# EAGLE design control_boardv15 (EAGLE 9.5.2)
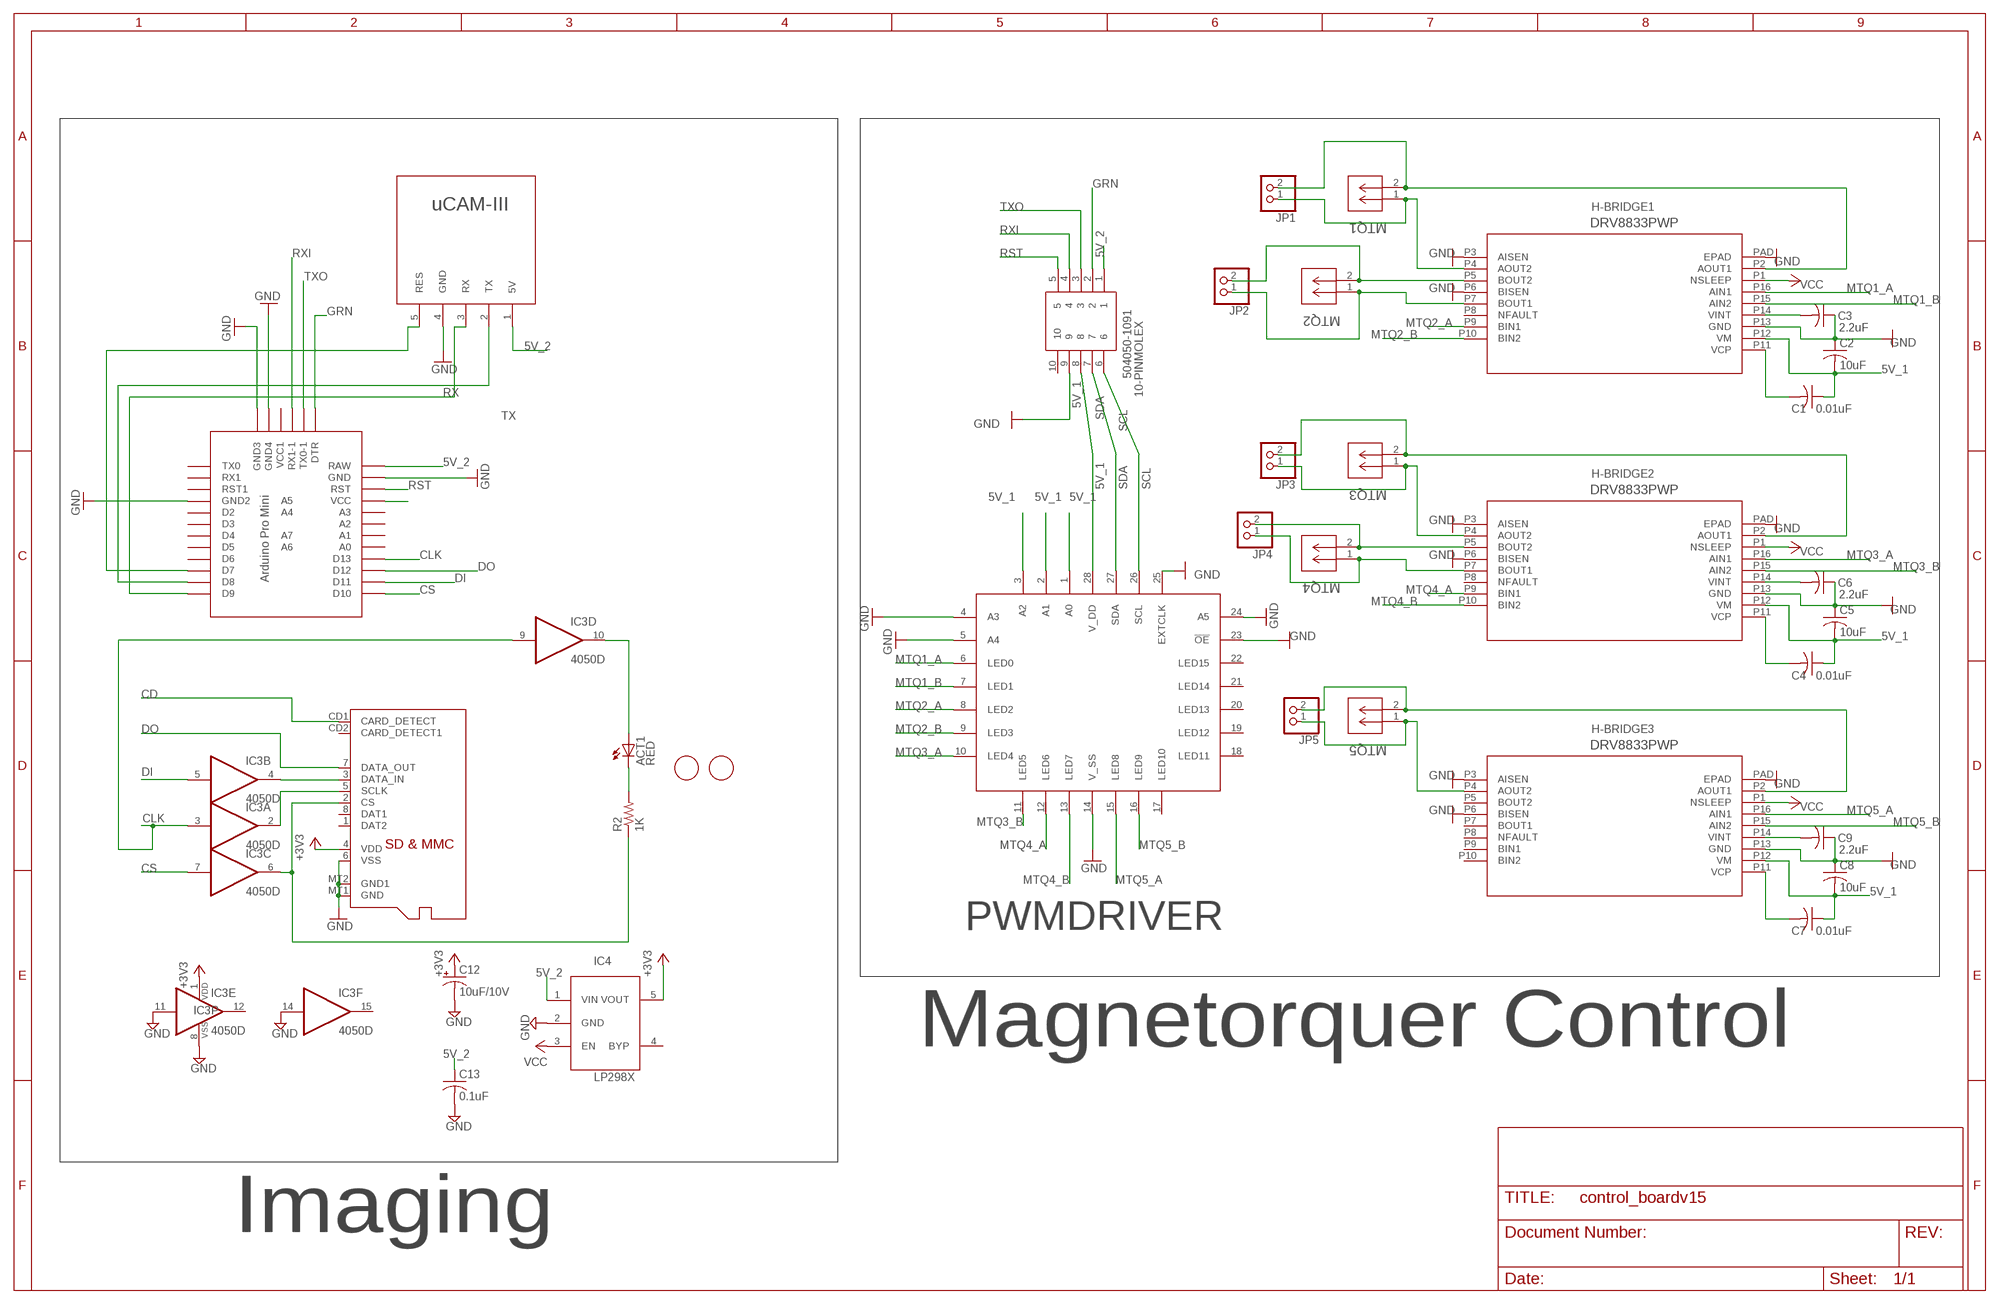
[diagram p0: schematic, sheet 1]

## Parts
10-PINMOLEX  504050-1091  [504050-1091]
ACT1  RED  LEDCHIP-LED0805  [CHIP-LED0805]
C1  0.01uF  C-USC0603K  [C0603K]
C2  10uF  C-USC1210K  [C1210K]
C3  2.2uF  C-USC0603K  [C0603K]
C4  0.01uF  C-USC0603K  [C0603K]
C5  10uF  C-USC1210K  [C1210K]
C6  2.2uF  C-USC0603K  [C0603K]
C7  0.01uF  C-USC0603K  [C0603K]
C8  10uF  C-USC1210K  [C1210K]
C9  2.2uF  C-USC0603K  [C0603K]
C12  10uF/10V  CPOL-USA/3216-18R  [A/3216-18R]
C13  0.1uF  C-USC0805K  [C0805K]
H-BRIDGE1  DRV8833PWP  [HTSSOP16]
H-BRIDGE2  DRV8833PWP  [HTSSOP16]
H-BRIDGE3  DRV8833PWP  [HTSSOP16]
IC3  4050D  [SO16]
IC4  LP298XS  [SOT23-5L]
JP1  PINHD-1X2  [1X02]
JP2  PINHD-1X2  [1X02]
JP3  PINHD-1X2  [1X02]
JP4  PINHD-1X2  [1X02]
JP5  PINHD-1X2  [1X02]
MTQ1  DF13C-2P-1.25V(51)  [CON2_1X2_U_DF13]
MTQ2  DF13C-2P-1.25V(51)  [CON2_1X2_U_DF13]
MTQ3  DF13C-2P-1.25V(51)  [CON2_1X2_U_DF13]
MTQ4  DF13C-2P-1.25V(51)  [CON2_1X2_U_DF13]
MTQ5  DF13C-2P-1.25V(51)  [CON2_1X2_U_DF13]
PWMDRIVER  PCA9685PW  [TSSOP28]
R2  1K  R-US_R0805  [R0805]
U$2  UCAM-III  [UCAM-III]
U$6  FIDUCIAL  [FIDUCIAL_1MM]
U$7  FIDUCIAL  [FIDUCIAL_1MM]
U$8  PRO-MINI-2  [PRO-MINI-2]
X2  MICROSD  [MICROSD]

## Nets
5V_1 [New Class]: 10-PINMOLEX.8 C1.1 C2.2 C4.1 C5.2 C7.1 C8.2 H-BRIDGE1.P12(VM) H-BRIDGE2.P12(VM) H-BRIDGE3.P12(VM) PWMDRIVER.1(A0) PWMDRIVER.2(A1) PWMDRIVER.3(A2) PWMDRIVER.28(V_DD)
5V_2 [New Class]: 10-PINMOLEX.1 C13.1 IC4.1(VIN) U$2.1(5V) U$8.RAW
+3V3: C12.+ IC3.1(P:VDD) IC4.5(VOUT) X2.4(VDD)
CD: X2.CD1(CARD_DETECT)
CLK: IC3.3(A:I) IC3.9(D:I) U$8.D13
CS: IC3.7(C:I) U$8.D10
DI: IC3.5(B:I) U$8.D11
DO: U$8.D12 X2.7(DATA_OUT)
GND [MTQs]: 10-PINMOLEX.9 C2.1 C3.1 C5.1 C6.1 C8.1 C9.1 C12.- C13.2 H-BRIDGE1.P3(AISEN) H-BRIDGE1.P6(BISEN) H-BRIDGE1.P13(GND) H-BRIDGE1.PAD(EPAD) H-BRIDGE2.P3(AISEN) H-BRIDGE2.P6(BISEN) H-BRIDGE2.P13(GND) H-BRIDGE2.PAD(EPAD) H-BRIDGE3.P3(AISEN) H-BRIDGE3.P6(BISEN) H-BRIDGE3.P13(GND) H-BRIDGE3.PAD(EPAD) IC3.8(P:VSS) IC3.11(E:I) IC3.14(F:I) IC4.2(GND) PWMDRIVER.4(A3) PWMDRIVER.5(A4) PWMDRIVER.14(V_SS) PWMDRIVER.23(!OE) PWMDRIVER.24(A5) PWMDRIVER.25(EXTCLK) U$2.4(GND) U$8.GND U$8.GND1(GND2) U$8.GND2(GND3) U$8.GND3(GND4) X2.6(VSS) X2.MT1(GND) X2.MT2(GND1)
GRN: 10-PINMOLEX.2 U$8.DTR
MTQ1_A: H-BRIDGE1.P16(AIN1) PWMDRIVER.6(LED0)
MTQ1_B: H-BRIDGE1.P15(AIN2) PWMDRIVER.7(LED1)
MTQ2_A: H-BRIDGE1.P9(BIN1) PWMDRIVER.8(LED2)
MTQ2_B: H-BRIDGE1.P10(BIN2) PWMDRIVER.9(LED3)
MTQ3_A: H-BRIDGE2.P16(AIN1) PWMDRIVER.10(LED4)
MTQ3_B: H-BRIDGE2.P15(AIN2) PWMDRIVER.11(LED5)
MTQ4_A: H-BRIDGE2.P9(BIN1) PWMDRIVER.12(LED6)
MTQ4_B: H-BRIDGE2.P10(BIN2) PWMDRIVER.13(LED7)
MTQ5_A: H-BRIDGE3.P16(AIN1) PWMDRIVER.15(LED8)
MTQ5_B: H-BRIDGE3.P15(AIN2) PWMDRIVER.16(LED9)
N$1 [MTQs]: H-BRIDGE2.P2(AOUT1) JP3.2 MTQ3.2
N$2: C3.2 H-BRIDGE1.P14(VINT)
N$3 [MTQs]: H-BRIDGE1.P4(AOUT2) JP1.1 MTQ1.1
N$4 [MTQs]: H-BRIDGE1.P2(AOUT1) JP1.2 MTQ1.2
N$5 [MTQs]: H-BRIDGE1.P7(BOUT1) JP2.1 MTQ2.1
N$6 [MTQs]: H-BRIDGE1.P5(BOUT2) JP2.2 MTQ2.2
N$7: C1.2 H-BRIDGE1.P11(VCP)
N$8 [MTQs]: H-BRIDGE2.P7(BOUT1) JP4.1 MTQ4.1
N$9 [MTQs]: H-BRIDGE2.P5(BOUT2) JP4.2 MTQ4.2
N$10: C6.2 H-BRIDGE2.P14(VINT)
N$11: C4.2 H-BRIDGE2.P11(VCP)
N$12 [MTQs]: H-BRIDGE2.P4(AOUT2) JP3.1 MTQ3.1
N$13 [MTQs]: H-BRIDGE3.P2(AOUT1) JP5.2 MTQ5.2
N$16: C9.2 H-BRIDGE3.P14(VINT)
N$17: C7.2 H-BRIDGE3.P11(VCP)
N$18 [MTQs]: H-BRIDGE3.P4(AOUT2) JP5.1 MTQ5.1
N$21: U$8.VCC
N$22: ACT1.A IC3.10(D:O)
N$23: IC3.2(A:O) X2.5(SCLK)
N$24: IC3.6(C:O) R2.1 X2.2(CS)
N$25: ACT1.C R2.2
N$26: IC3.4(B:O) X2.3(DATA_IN)
N$27: U$2.5(RES) U$8.D7
RST: 10-PINMOLEX.5 U$8.RST
RX: U$2.3(RX) U$8.D9
RXI: 10-PINMOLEX.4 U$8.RX1-1
SCL: 10-PINMOLEX.6 PWMDRIVER.26(SCL)
SDA: 10-PINMOLEX.7 PWMDRIVER.27(SDA)
TX: U$2.2(TX) U$8.D8
TXO: 10-PINMOLEX.3 U$8.TX0-1
VCC: H-BRIDGE1.P1(NSLEEP) H-BRIDGE2.P1(NSLEEP) H-BRIDGE3.P1(NSLEEP) IC4.3(EN)
Unconnected: 10-PINMOLEX.10 H-BRIDGE1.P8(NFAULT) H-BRIDGE2.P8(NFAULT) H-BRIDGE3.P5(BOUT2) H-BRIDGE3.P7(BOUT1) H-BRIDGE3.P8(NFAULT) H-BRIDGE3.P9(BIN1) H-BRIDGE3.P10(BIN2) IC3.12(E:O) IC3.15(F:O) IC4.4(BYP) PWMDRIVER.17(LED10) PWMDRIVER.18(LED11) PWMDRIVER.19(LED12) PWMDRIVER.20(LED13) PWMDRIVER.21(LED14) PWMDRIVER.22(LED15) U$8.A0 U$8.A1 U$8.A2 U$8.A3 U$8.A4 U$8.A5 U$8.A6 U$8.A7 U$8.D2 U$8.D3 U$8.D4 U$8.D5 U$8.D6 U$8.RST1 U$8.RX1 U$8.TX0 U$8.VCC1 X2.1(DAT2) X2.8(DAT1) X2.CD2(CARD_DETECT1)

## Notes on the sheet
- Magnetorquer Control
- Imaging

## Library data of the parts
10-PINMOLEX = molex_10pin:504050-1091: Pico-Lock SMT Wire-to-Board Header 10way Molex 504050 Series, 1.5mm Pitch 10 Way 1 Row Right Angle PCB Header, SMT Termination, 3A Source: Datasheet <https://componentsearchengine.com/Datasheets/1/504050-1091.pdf>; DESCRIPTION: Pico-Lock SMT Wire-to-Board Header 10way Molex 504050 Series, 1.5mm Pitch 10 Way 1 Row Right Angle PCB Header, SMT Termination, 3A; HEIGHT: mm; MANUFACTURER_NAME: Molex; MANUFACTURER_PART_NUMBER: 504050-1091; MOUSER_PART_NUMBER: 538-504050-1091; MOUSER_PRICE-STOCK: https://www.mouser.com/Search/Refine.aspx?Keyword=538-504050-1091
ACT1 = adafruit:LED: LED OSRAM: - CHIPLED LG R971, LG N971, LY N971, LG Q971, LY Q971, LO R971, LY R971 LH N974, LH R974 LS Q976, LO Q976, LY Q976 LO Q996 - Hyper CHIPLED LW Q18S LB Q993, LB Q99A, LB R99A - SideLED LS A670, LO A670, LY A670, LG A670, LP A670 LB A673, LV A673, LT A673, LW A673 LH A674 LY A675 LS A676, LA A676, LO A676, LY A676, LW A676 LS A679, LY A679, LG A679 - Hyper Micro SIDELED® LS Y876, LA Y876, LO Y876, LY Y876 LT Y87S - SmartLED LW L88C, LW L88S LB L89C, LB L89S, LG L890 LS L89K, LO L89K, LY L89K LS L896, LA L896, LO L896, LY L896 - TOPLED LS T670, LO T670, LY T670, LG T670, LP T670 LSG T670, LSP T670, LSY T670, LOP T670, LYG T670 LG T671, LOG T671, LSG T671 LB T673, LV T673, LT T673, LW T673 LH T674 LS T676, LA T676, LO T676, LY T676, LB T676, LH T676, LSB T676, LW T676 LB T67C, LV T67C, LT T67C, LS T67K, LO T67K, LY T67K, LW E67C LS E67B, LA E67B, LO E67B, LY E67B, LB E67C, LV E67C, LT E67C LW T67C LS T679, LY T679, LG T679 LS T770, LO T770, LY T770, LG T770, LP T770 LB T773, LV T773, LT T773, LW T773 LH T774 LS E675, LA E675, LY E675, LS T675 LS T776, LA T776, LO T776, LY T776, LB T776 LHGB T686 LT T68C, LB T68C - Hyper Mini TOPLED® LB M676 - Mini TOPLED Santana® LG M470 LS M47K, LO M47K, LY M47K Source: http://www.osram.convergy.de/
C1-C9 = rcl:C-US: CAPACITOR, American symbol; SPICEPREFIX: C
C12 = adafruit:CPOL-US: POLARIZED CAPACITOR, American symbol
C13 = adafruit:C-US: CAPACITOR, American symbol
H-BRIDGE1-H-BRIDGE3 = myparts:DRV8833PWP
IC3 = 40xx:4050: Hex non-inverting BUFFER
IC4 = adafruit:LP298X
JP1-JP5 = pinhead:PINHD-1X2: PIN HEADER
MTQ1-MTQ5 = myparts:DF13C-2P-1.25V(51); BUILT_BY: EMA_UL_Team; MANUFACTURER_PART_NUMBER: DF13C-2P-1.25V(51); VENDOR: Hirose
PWMDRIVER = myparts:PCA9685PW
R2 = adafruit:R-US_: RESISTOR, American symbol
U$2 = myparts:UCAM-III
U$6 U$7 = adafruit:FIDUCIAL: For use by pick and place machines to calibrate the vision/machine, 1mm By microbuilder.eu
U$8 = myparts:PRO-MINI-2: Arduino Pro Mini Layout 2 Sparkfun.com
X2 = adafruit:MICROSD: Micro-SD / Transflash card holder with SPI pinout For the 3M # 2908-05WB-MG and/or 4UCON #19656 push-push type

## Net classes
0 default: width 0.152 mm
1 New Class: width 0.457 mm
2 MTQs: width 0.305 mm

## Board
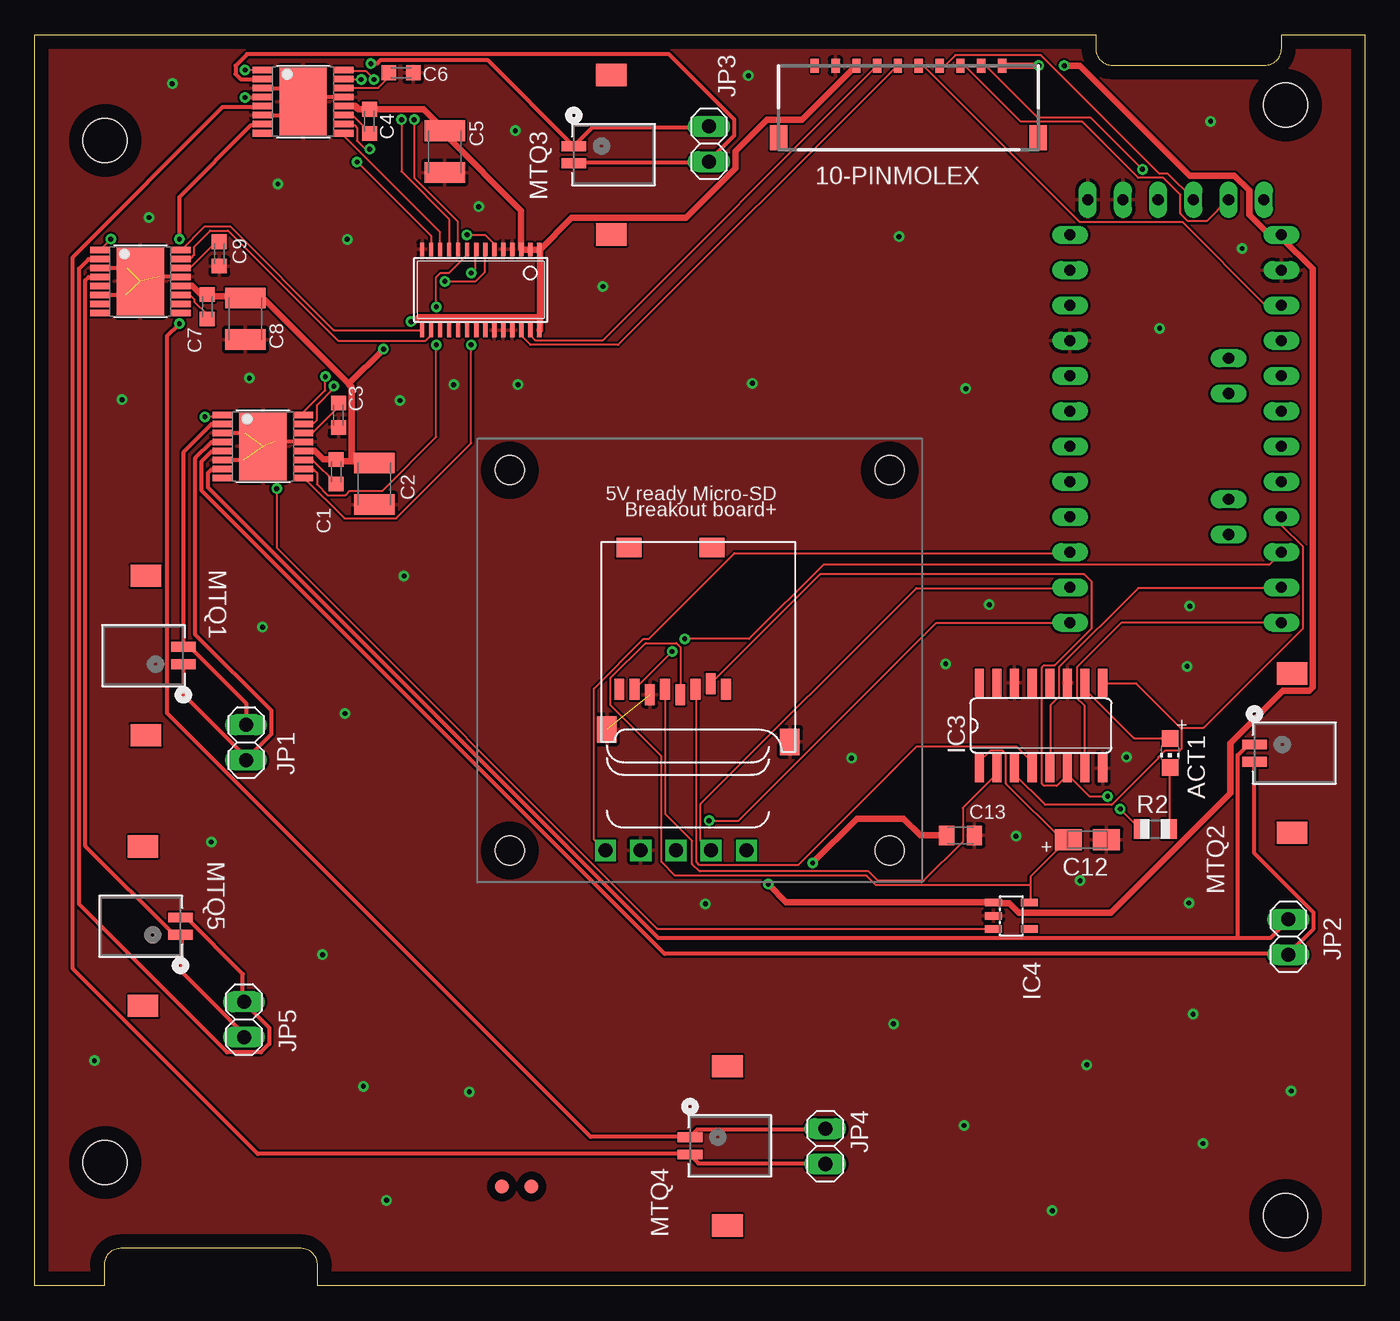
[diagram p1: board, top side]
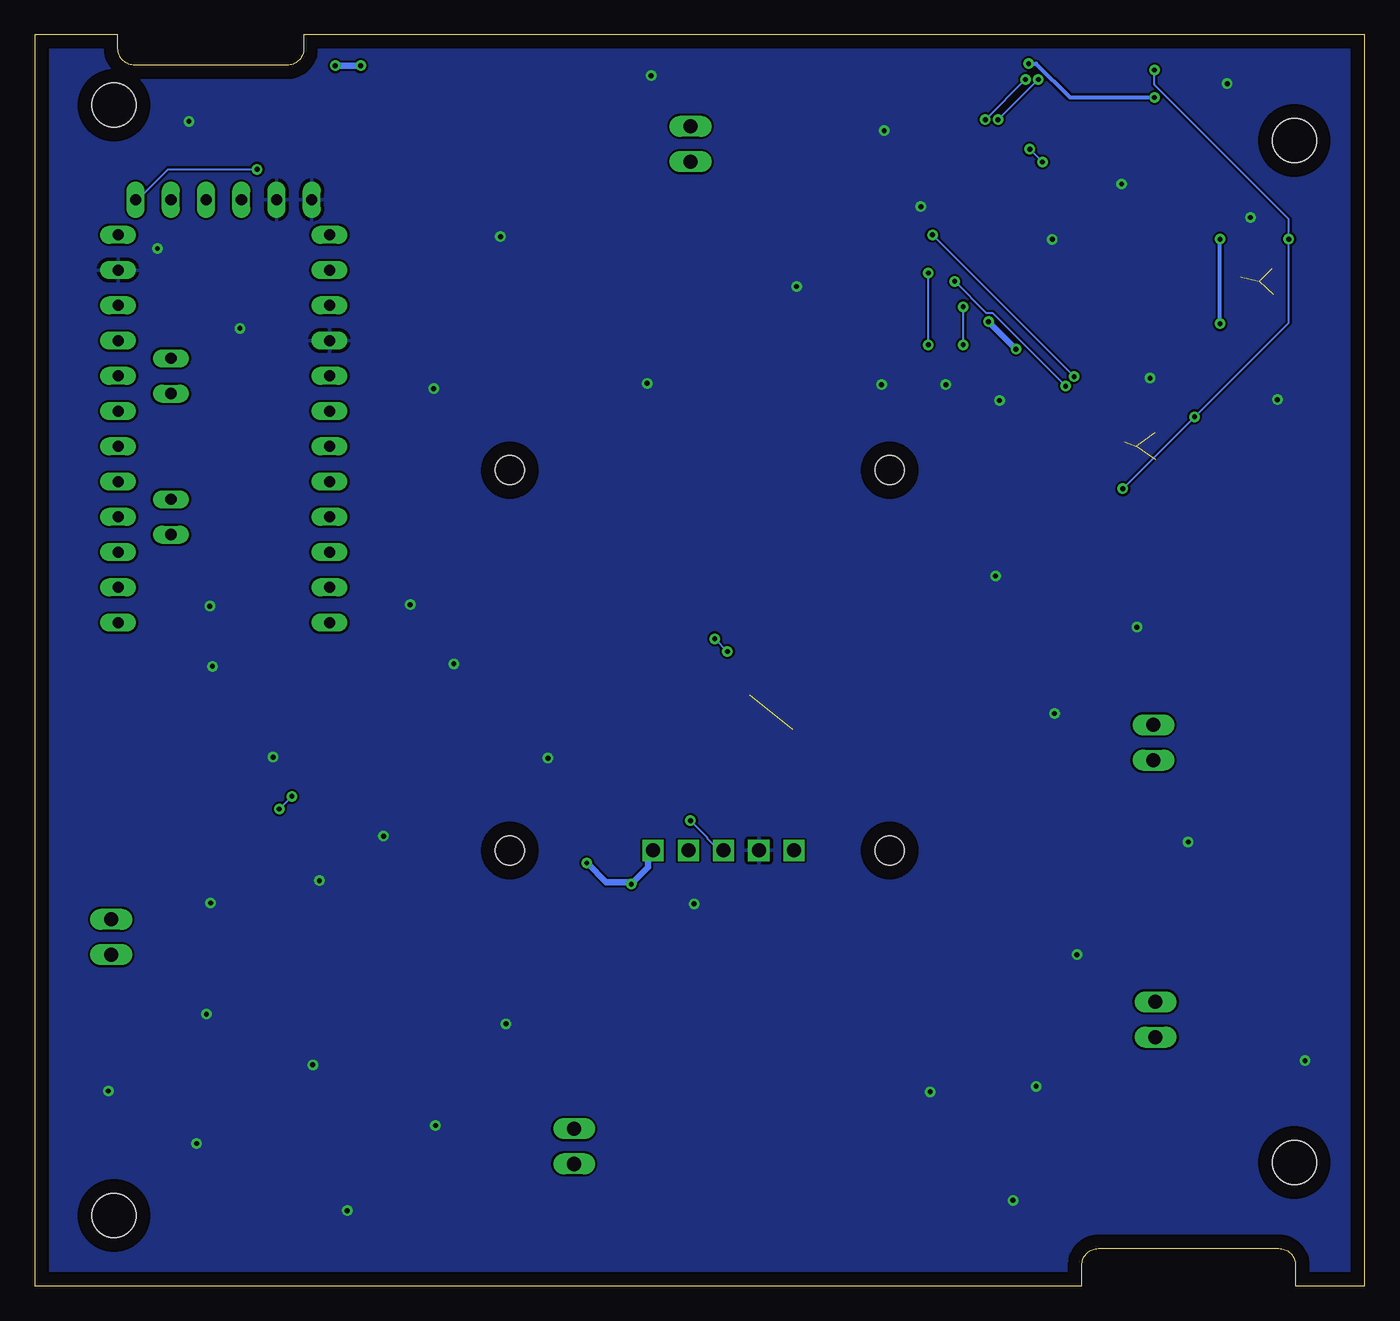
[diagram p2: board, bottom side, seen from below]

Size 95.89 x 90.17 mm. Coordinates in mm from the lower left corner, seen from the top.
Outline: 20.4,0 20.4,1.5 arc90 19.2,2.7 6.2,2.7 arc90 5,1.5 5,0 0,0 0,90.17 76.49,90.17 76.49,89.17 arc90 77.69,87.97 88.69,87.97 arc90 89.89,89.17 89.89,90.17 95.89,90.17 95.89,0 20.4,0
Copper layers (1*16): Top 0.035mm / dielectric 1.5mm / Bottom 0.035mm
Design rules "default": minimum track width 6mil, minimum drill 0.35mm, track to track 6mil, track to pad 6mil, pad to pad 6mil, via to via 6mil, smd to smd 6mil, copper to edge 40mil, drill to drill 6mil, minimum pad ring 10mil, minimum via ring 8mil, stop-mask expansion 4mil, vias tented up to drill 0mil, thermal gap 10mil
Holes 3.17 mm at 5.08,82.55 5.08,8.89 90.17,5.08 90.17,85.09

### Footprints (pad centres in the part's own frame; a part is rotated, then mirrored left to right if it is on the bottom)
504050-1091 = smd 0.6 x 1: 1 -13.5,0; 2 -12,0; 3 -10.5,0; 4 -9,0; 5 -7.5,0; 6 -6,0; 7 -4.5,0; 8 -3,0; 9 -1.5,0; 10 0,0 | smd 1.25 x 1.8: 11 2.605,5.19; 12 -16.105,5.19
CHIP-LED0805 = smd 1.2 x 1.2: A 0,-1.05; C 0,1.05
C0603K = smd 1.05 x 1.08: 1 -0.875,0; 2 0.875,0
C1210K = smd 1.5 x 2.9: 1 -1.5,0; 2 1.5,0
A/3216-18R = smd 1.95 x 1.5: + 1.375,0; - -1.375,0
C0805K = smd 1.1 x 1.4: 1 -1,0; 2 1,0
HTSSOP16 = smd 1.5 x 0.45: P1 -2.9,2.275; P2 -2.9,1.625; P3 -2.9,0.975; P4 -2.9,0.325; P5 -2.9,-0.325; P6 -2.9,-0.975; P7 -2.9,-1.625; P8 -2.9,-2.275; P9 2.9,-2.275; P10 2.9,-1.625; P11 2.9,-0.975; P12 2.9,-0.325; P13 2.9,0.325; P14 2.9,0.975; P15 2.9,1.625; P16 2.9,2.275 | smd 3.4 x 5: PAD 0,0
SO16 = smd 0.66 x 2.032: 1 -4.445,-3.073; 2 -3.175,-3.073; 3 -1.905,-3.073; 4 -0.635,-3.073; 5 0.635,-3.073; 6 1.905,-3.073; 7 3.175,-3.073; 8 4.445,-3.073; 9 4.445,3.073; 10 3.175,3.073; 11 1.905,3.073; 12 0.635,3.073; 13 -0.635,3.073; 14 -1.905,3.073; 15 -3.175,3.073; 16 -4.445,3.073
SOT23-5L = smd 0.55 x 1.2: 1 -0.95,-1.3; 2 0,-1.3; 3 0.95,-1.3; 4 0.95,1.3; 5 -0.95,1.3
1X02 = drill 1.016 long: 1 -1.27,0; 2 1.27,0
CON2_1X2_U_DF13 = smd 0.711 x 1.778: 1 0,0; 2 -1.25,0 | smd 1.6 x 2.21: 3 -6.365,-2.7; 5 5.115,-2.7
TSSOP28 = smd 0.305 x 0.991: 1 -4.225,-2.918; 2 -3.575,-2.918; 3 -2.925,-2.918; 4 -2.275,-2.918; 5 -1.625,-2.918; 6 -0.975,-2.918; 7 -0.325,-2.918; 8 0.325,-2.918; 9 0.975,-2.918; 10 1.625,-2.918; 11 2.275,-2.918; 12 2.925,-2.918; 13 3.575,-2.918; 14 4.225,-2.918; 15 4.225,2.918; 16 3.575,2.918; 17 2.925,2.918; 18 2.275,2.918; 19 1.625,2.918; 20 0.975,2.918; 21 0.325,2.918; 22 -0.325,2.918; 23 -0.975,2.918; 24 -1.625,2.918; 25 -2.275,2.918; 26 -2.925,2.918; 27 -3.575,2.918; 28 -4.225,2.918
R0805 = smd 1.1 x 1.4: 1 -1,0; 2 1,0
UCAM-III = drill 1.02 square: 1 19.36,2.3; 2 16.82,2.3; 3 14.28,2.3; 4 11.74,2.3; 5 9.2,2.3 | hole 2.1: 2.3,2.3; 29.7,2.3; 29.7,29.7; 2.3,29.7
FIDUCIAL_1MM = smd 1 x 1: 1 0,0
PRO-MINI-2 = drill 0.8 long: A0 6.35,2.54; A1 6.35,0; A2 6.35,-2.54; A3 6.35,-5.08; A4 2.54,1.27; A5 2.54,3.81; A6 2.54,-8.89; A7 2.54,-6.35; D2 -8.89,2.54; D3 -8.89,0; D4 -8.89,-2.54; D5 -8.89,-5.08; D6 -8.89,-7.62; D7 -8.89,-10.16; D8 -8.89,-12.7; D9 -8.89,-15.24; D10 6.35,-15.24; D11 6.35,-12.7; D12 6.35,-10.16; D13 6.35,-7.62; DTR 5.08,15.24; GND 6.35,10.16; GND1 -8.89,5.08; GND2 -7.62,15.24; GND3 -5.08,15.24; RAW 6.35,12.7; RST 6.35,7.62; RST1 -8.89,7.62; RX1 -8.89,10.16; RX1-1 0,15.24; TX0 -8.89,12.7; TX0-1 2.54,15.24; VCC 6.35,5.08; VCC1 -2.54,15.24
MICROSD = smd 0.7 x 1.5: 1 9,-10.64; 2 7.9,-10.24; 3 6.8,-10.64; 4 5.7,-11.04; 5 4.6,-10.64; 6 3.5,-11.04; 7 2.4,-10.64; 8 1.3,-10.64 | smd 1.8 x 1.4: CD1 2,-0.44; CD2 8,-0.44 | smd 1.4 x 1.9: MT1 0.4,-13.54; MT2 13.6,-14.44

### Placement (x,y rotation side)
10-PINMOLEX  56.24,87.93 180 top
ACT1  81.84,38.4 180 top
C1  21.74,58.67 270 top
C2  24.49,57.81 90 top
C3  21.89,62.74 90 top
C4  24.13,83.92 270 top
C5  29.57,81.74 90 top
C6  26.42,87.43 180 top
C7  12.45,70.56 270 top
C8  15.19,69.7 90 top
C9  13.31,74.37 90 top
C12  75.9,32.16 180 top
C13  66.75,32.46 0 top
H-BRIDGE1  16.46,60.5 0 top
H-BRIDGE2  19.35,85.34 0 top
H-BRIDGE3  7.62,72.39 0 top
IC3  72.54,40.39 0 top
IC4  70.41,26.67 270 top
JP1  15.24,39.17 90 top
JP2  90.37,25.15 270 top
JP3  48.62,82.3 270 top
JP4  57,10.06 270 top
JP5  15.09,19.2 90 top
MTQ1  10.72,44.81 270 top
MTQ2  87.93,39.01 90 top
MTQ3  38.86,82.14 90 top
MTQ4  47.24,10.72 90 top
MTQ5  10.52,25.3 270 top
PWMDRIVER  32.16,71.78 180 top
R2  80.77,32.92 0 top
U$2  31.95,29.09 0 top
U$6  33.68,7.16 0 top
U$7  35.81,7.16 0 top
U$8  83.53,63.04 0 top
X2  40.84,53.64 0 top

### Tracks (layer width: path | path; a pad name or v marks a point on that pad's centre or on a via)
5V_1  (via drill 0.35)
  Top 0.457: H-BRIDGE3.P12 10.59,72.08 11.35,72.08 11.96,71.48 12.42,71.48 C7.1 12.65,71.32 15.09,71.32 15.16,71.25 C8.2 15.39,71.09 16.54,71.09 22.63,65 | H-BRIDGE1.P12 19.43,60.2 20.19,60.2 20.8,59.59 21.72,59.59 C1.1 21.95,59.44 22.86,59.44 | 22.86,59.44 24.38,59.44 24.46,59.36 C2.2 | 22.63,65 22.86,64.77 22.86,59.44 | H-BRIDGE2.P12 22.33,85.04 23.09,85.04 23.32,84.81 24.08,84.81 C4.1 24.31,84.81 28.04,84.81 29.57,83.29 C5.2 29.64,83.06 29.64,82.91 35.05,77.5 35.05,74.91 PWMDRIVER.3 35.13,74.68 35.66,74.68 PWMDRIVER.2 35.97,74.68 36.2,74.68 PWMDRIVER.1 36.42,74.68 | 36.42,74.68 36.42,69.8 | 36.42,69.8 36.42,68.89 PWMDRIVER.28 | 36.42,74.68 38.71,76.96 46.94,76.96 50.52,80.54 50.52,81.76 52.81,84.05 55.32,84.05 59.21,87.94 10-PINMOLEX.8 | v25.15,67.51 22.63,65 | v27.13,69.49 27.36,69.49 27.66,69.8 36.42,69.8
  Bottom 0.457: v27.13,69.49 v25.15,67.51
5V_2  (via drill 0.35)
  Top 0.457: v52.88,28.96 54.18,27.66 69.04,27.66 IC4.1 69.34,27.58 70.26,27.58 70.94,26.9 77.57,26.9 86.18,35.51 86.18,39.09 89.99,42.9 91.9,42.9 92.13,43.13 92.13,73.3 89.92,75.51 U$8.RAW 89.84,75.74 89,75.74 87.55,77.19 87.55,78.94 86.49,80.01 83.29,80.01 75.36,87.94 v74.22,87.94 | C13.1 63.86,32.46 62.64,33.68 59.28,33.68 v56.08,30.48 | v72.39,87.94 10-PINMOLEX.1
  Bottom 0.457: U$2.1 51.36,31.32 51.66,31.01 51.66,30.18 v52.88,28.96 53.03,29.11 54.71,29.11 v56.08,30.48 | v74.22,87.94 v72.39,87.94
+3V3
  Top 0.152: 71.78,28.88 71.78,29.49 74.45,32.16 C12.+ 74.22,32 70.03,36.2 70.03,38.33 69.8,38.56 68.89,38.56 68.12,37.8 68.12,37.34 IC3.1 | 71.78,28.88 71.78,27.66 IC4.5 | 71.78,28.88 60.66,28.88 59.97,29.57 46.18,29.57 45.19,30.56 45.19,38.18 41.53,41.83 41.53,43.81 44.04,46.33 46.25,46.33 46.56,46.02 46.56,42.67 X2.4
CLK
  Top 0.152: IC3.3 70.64,36.88 72.85,34.67 77.65,34.67 81,38.02 81,38.1 81.46,38.56 82.53,38.56 82.68,38.71 82.68,40.16 82.64,40.2 | 82.64,40.2 79.4,43.43 77.04,43.43 IC3.9 | U$8.D13 89.92,55.4 89.92,54.79 91.44,53.26 91.44,47.4 84.28,40.23 82.68,40.23 82.64,40.2
CS
  Top 0.152: IC3.7 75.67,37.34 75.67,41.83 75.13,42.37 75.13,44.58 78.33,47.78 89.84,47.78 U$8.D10
DI
  Top 0.152: IC3.5 73.23,37.34 73.23,41.83 73.84,42.44 73.84,44.58 79.55,50.29 89.84,50.29 U$8.D11
DO  (via drill 0.35)
  Top 0.152: v45.95,45.72 43.28,43.05 X2.7 | v46.86,46.63 51.51,46.63 56.84,51.97 89,51.97 89.84,52.81 U$8.D12
  Bottom 0.152: v46.86,46.63 v45.95,45.72
GND  (via drill 0.35)  (7 unrouted)
  Top 0.305: H-BRIDGE3.P3 6.66,73.36 6.67,73.36 | H-BRIDGE3.P6 6.55,71.42 | H-BRIDGE3.P13 8.99,72.72 | H-BRIDGE2.P3 18.22,86.32 | H-BRIDGE2.P6 18.03,84.37 18.05,84.39 | H-BRIDGE2.P13 20.04,85.67 20.02,85.69 | H-BRIDGE1.P3 15.11,61.48 15.12,61.49 | H-BRIDGE1.P6 15.05,59.53 15.08,59.55 | H-BRIDGE1.P13 17.36,60.83 17.35,60.84
  other vias: 9.93,86.64 17.53,79.41 8.26,77 6.3,63.87 22.54,75.42 15.48,65.42 16.43,47.48 22.38,41.25 26.62,51.16 34.84,64.94 30.21,64.94 26.34,63.81 34.65,83.25 32.01,77.78 51.45,87.22 40.97,72.03 51.73,65.04 62.3,75.61 67.12,64.66 81.09,69 84.78,83.92 87.04,74.76 83.27,48.99 83.08,44.65 68.83,49.09 65.67,44.83 58.88,38.03 70.74,32.41 78.7,38.1 75.37,29.2 83.2,27.6 48.35,27.53 61.92,18.89 67,11.56 73.36,5.43 75.84,15.93 83.5,19.59 84.22,10.27 90.58,14.04 12.73,31.99 20.75,23.87 23.7,14.38 31.33,13.99 25.36,6.17 4.31,16.24
  pour Top: -3.17,94.42 95.66,94.42 103.89,86.19 103.89,-9.91 103.14,-10.66 -0.93,-10.66 -8.04,-3.56 -8.04,89.56
  pour Bottom: -4.42,97.86 98.31,97.86 110.08,86.09 110.08,3.18 91.94,-14.96 8.1,-14.96 -15.94,9.07 -15.94,86.34
GRN  (via drill 0.35)
  Top 0.152: 10-PINMOLEX.2 68.58,87.94 72.31,84.2 76.12,84.2 v79.86,80.47
  Bottom 0.152: v79.86,80.47 86.26,80.47 88.39,78.33 88.54,78.33 U$8.DTR
MTQ1_A  (via drill 0.35)
  Top 0.152: v31.17,75.74 32.46,75.74 33.07,75.13 33.07,74.75 PWMDRIVER.6 | v20.95,65.53 20.95,64.54 19.43,63.02 19.43,62.79 H-BRIDGE1.P16
  Bottom 0.152: v20.95,65.53 v31.17,75.74
MTQ1_B  (via drill 0.35)
  Top 0.152: v29.57,72.39 31.77,72.39 32.46,73.08 32.46,74.68 PWMDRIVER.7 | v21.57,64.85 21.57,64.69 20.34,63.48 20.34,62.41 20.12,62.18 19.43,62.18 H-BRIDGE1.P15
  Bottom 0.152: v29.57,72.39 27.28,70.1 26.82,70.1 v21.57,64.85
MTQ2_A  (via drill 0.35)
  Top 0.152: v31.47,73 31.77,73.3 31.77,74.68 PWMDRIVER.8 | v31.47,67.82 31.47,60.73 26.06,55.32 22.33,55.32 19.43,58.22 H-BRIDGE1.P9
  Bottom 0.152: v31.47,67.82 v31.47,73
MTQ2_B  (via drill 0.35)
  Top 0.152: v28.96,70.56 28.96,72.69 29.26,73 29.87,73 31.17,74.3 31.17,74.68 PWMDRIVER.9 | v28.96,67.82 28.96,61.19 25.07,57.3 22.71,57.3 22.4,57 21.11,57 20.34,57.76 20.34,58.6 20.12,58.83 19.43,58.83 H-BRIDGE1.P10
  Bottom 0.152: v28.96,67.82 v28.96,70.56
MTQ3_A  (via drill 0.35)
  Top 0.152: v27.36,84.05 27.36,79.86 30.48,76.73 30.48,74.75 PWMDRIVER.10 | v24.46,86.94 23.85,87.55 22.33,87.55 H-BRIDGE2.P16
  Bottom 0.152: v24.46,86.94 v27.36,84.05
MTQ3_B  (via drill 0.35)
  Top 0.152: v26.44,84.05 26.44,80.31 29.87,76.89 29.87,74.75 PWMDRIVER.11 | v23.55,86.94 22.33,86.94 H-BRIDGE2.P15
  Bottom 0.152: v23.55,86.94 v26.44,84.05
MTQ4_A
  Top 0.152: PWMDRIVER.12 29.18,74.75 29.18,75.97 22.33,82.83 22.33,83.06 H-BRIDGE2.P9
MTQ4_B  (via drill 0.35)
  Top 0.152: v23.24,81 28.57,75.67 28.57,74.75 PWMDRIVER.13 | v24.16,81.92 23.85,81.92 23.24,82.53 23.24,83.44 23.01,83.67 22.33,83.67 H-BRIDGE2.P10
  Bottom 0.152: v24.16,81.92 v23.24,81
MTQ5_A
  Top 0.152: PWMDRIVER.15 27.89,68.89 21.57,68.89 14.1,76.35 12.27,76.35 10.59,74.68 H-BRIDGE3.P16
MTQ5_B
  Top 0.152: PWMDRIVER.16 28.57,68.81 28.57,68.5 28.19,68.12 21.87,68.12 13.95,76.05 12.65,76.05 11.51,74.91 11.51,74.3 11.28,74.07 10.59,74.07 H-BRIDGE3.P15
N$1
  Top 0.305: H-BRIDGE2.P2 16.38,86.94 14.86,86.94 14.48,87.33 14.48,87.94 15.32,88.77 45.72,88.77 50.44,84.05 50.44,82.91 48.62,81.08 JP3.2 48.54,80.92 38.86,80.92 MTQ3.2
N$2
  Top 0.152: C3.2 21.87,63.55 21.87,63.32 20.04,61.49 19.43,61.49 H-BRIDGE1.P14
N$3
  Top 0.305: H-BRIDGE1.P4 13.49,60.81 12.72,60.81 11.58,59.66 11.58,46.94 17.07,41.45 17.07,39.78 15.24,37.95 JP1.1 15.24,38.1 10.74,42.6 10.74,44.81 MTQ1.1
N$4
  Top 0.305: H-BRIDGE1.P2 13.49,62.1 12.72,62.1 10.74,60.12 10.74,46.1 MTQ1.2 10.9,46.1 11.12,46.1 15.24,41.99 JP1.2
N$5
  Top 0.305: 86.72,25.07 89.08,25.07 90.37,26.36 JP2.1 | 86.72,25.07 44.96,25.07 12.5,57.53 12.5,58.6 12.72,58.83 13.49,58.83 H-BRIDGE1.P7 | MTQ2.1 87.48,39.01 86.72,38.25 86.72,25.07
N$6
  Top 0.305: H-BRIDGE1.P5 13.49,60.12 12.72,60.12 12.04,59.44 12.04,57.3 45.41,23.93 90.37,23.93 JP2.2 90.45,24 92.2,25.76 92.2,26.9 87.94,31.17 MTQ2.2
N$7
  Top 0.152: C1.2 21.72,57.84 20.04,59.51 19.43,59.51 H-BRIDGE1.P11
N$8  (via drill 0.35)
  Top 0.305: v10.44,75.44 10.44,78.49 15.62,83.67 16.38,83.67 H-BRIDGE2.P7 | v10.44,69.34 9.53,68.43 9.53,41.3 40.08,10.74 47.24,10.74 MTQ4.1 47.32,10.82 47.78,11.28 57,11.28 JP4.1
  Bottom 0.305: v10.44,69.34 v10.44,75.44
N$9
  Top 0.305: H-BRIDGE2.P5 16.38,84.96 13.56,84.96 2.74,74.14 2.74,22.86 16.08,9.53 47.24,9.53 MTQ4.2 47.32,9.37 47.85,8.84 57,8.84 JP4.2
N$10
  Top 0.152: C6.2 25.53,87.4 25.53,87.1 24.77,86.33 22.33,86.33 H-BRIDGE2.P14
N$11
  Top 0.152: C4.2 24.08,83.06 24.08,83.21 22.94,84.35 22.33,84.35 H-BRIDGE2.P11
N$12  (via drill 0.35)
  Top 0.305: v15.16,85.65 16.38,85.65 H-BRIDGE2.P4 | v24.23,88.09 24.69,88.09 24.92,88.32 32.69,88.32 MTQ3.1 40.23,83.52 48.62,83.52 JP3.1
  Bottom 0.305: v15.16,85.65 21.26,85.65 23.7,88.09 v24.23,88.09
N$13
  Top 0.305: H-BRIDGE3.P2 4.65,73.99 3.89,73.99 3.2,73.3 3.2,27.51 13.87,16.84 16.31,16.84 16.92,17.45 16.92,18.59 15.09,20.42 JP5.2 15.01,20.57 15.01,22.48 10.97,26.52 10.52,26.52 MTQ5.2
N$16
  Top 0.152: C9.2 13.26,75.21 13.03,75.21 11.2,73.38 10.59,73.38 H-BRIDGE3.P14
N$17
  Top 0.152: C7.2 12.42,69.72 12.42,70.03 11.51,70.94 11.51,71.09 11.2,71.4 10.59,71.4 H-BRIDGE3.P11
N$18
  Top 0.305: H-BRIDGE3.P4 4.65,72.69 3.89,72.69 3.66,72.47 3.66,31.7 10.06,25.3 MTQ5.1 10.59,25.22 10.59,22.63 15.09,18.14 JP5.1
N$22
  Top 0.152: ACT1.A 81.84,39.47 79.25,39.47 75.74,42.98 75.74,43.43 IC3.10
N$23
  Top 0.152: X2.5 45.49,42.98 45.49,33.98 47.4,32.08 47.4,30.4 47.93,29.87 60.12,29.87 60.81,29.18 64.08,29.18 66.9,32 66.9,34.44 69.34,36.88 69.34,37.26 IC3.2
N$24  (via drill 0.35)
  Top 0.152: v78.26,34.37 79.7,32.92 R2.1 | v77.34,35.28 76.05,35.28 74.45,36.88 IC3.6 74.45,36.8 73.69,36.04 72.77,36.04 72.62,36.2 72.62,44.58 72.77,44.73 73.53,44.73 76.2,47.4 76.2,50.75 75.67,51.28 56.62,51.28 48.77,43.43 X2.2
  Bottom 0.152: v77.34,35.28 v78.26,34.37
N$25
  Top 0.152: ACT1.C 81.84,32.92 R2.2
N$26
  Top 0.152: X2.3 47.7,42.98 47.7,30.56 47.93,30.33 55.02,30.33 63.55,38.86 70.79,38.86 71.86,37.8 71.86,37.34 IC3.4
N$27
  Top 0.152: U$8.D7 74.6,52.81 50.44,52.81 44.27,46.63 43.89,46.63 40.31,43.05 40.31,32.16 41.07,31.39 U$2.5
RST
  Top 0.152: 10-PINMOLEX.5 64.08,87.94 75.36,76.66 82.75,76.66 88.7,70.71 89.84,70.71 U$8.RST
RX  (via drill 0.35)
  Top 0.152: v48.62,33.53 50.75,33.53 65,47.78 74.6,47.78 U$8.D9
  Bottom 0.152: v48.62,33.53 47.4,32.31 47.4,32.23 46.56,31.39 46.25,31.39 U$2.3
RXI
  Top 0.152: 10-PINMOLEX.4 65.61,87.94 66.37,88.7 72.54,88.7 81.08,80.16 81.69,80.16 83.52,78.33 U$8.RX1-1
SCL
  Top 0.152: PWMDRIVER.26 35.13,68.81 35.13,68.43 35.74,67.82 42.06,67.82 62.18,87.94 10-PINMOLEX.6
SDA
  Top 0.152: PWMDRIVER.27 35.74,68.81 35.74,68.5 36.12,68.12 40.92,68.12 10-PINMOLEX.7
TX
  Top 0.152: U$8.D8 74.6,50.29 63.55,50.29 48.01,34.75 48.01,32.08 48.69,31.39 U$2.2
TXO
  Top 0.152: 10-PINMOLEX.3 67.06,87.94 71.09,83.9 75.51,83.9 79.55,79.86 81.38,79.86 82.6,78.64 82.6,77.27 83.13,76.73 84.51,76.73 86.03,78.26 U$8.TX0-1
VCC  (via drill 0.35)
  Top 0.152: v17.45,57.45 17.45,53.19 44.88,25.76 69.04,25.76 IC4.3 | v12.27,62.64 13.41,62.64 13.49,62.71 H-BRIDGE1.P1 | v5.49,75.44 H-BRIDGE3.P1 | v15.16,87.63 16.38,87.63 H-BRIDGE2.P1
  Bottom 0.152: v17.45,57.45 v12.27,62.64 5.49,69.42 v5.49,75.44 5.49,76.89 15.16,86.56 v15.16,87.63

### Text on the board
tPlace: 5V ready Micro-SD | Breakout board+